# Altium schematic sheet 3) LPC1850_ PB-PF.SchDoc
size 420 x 297 mm
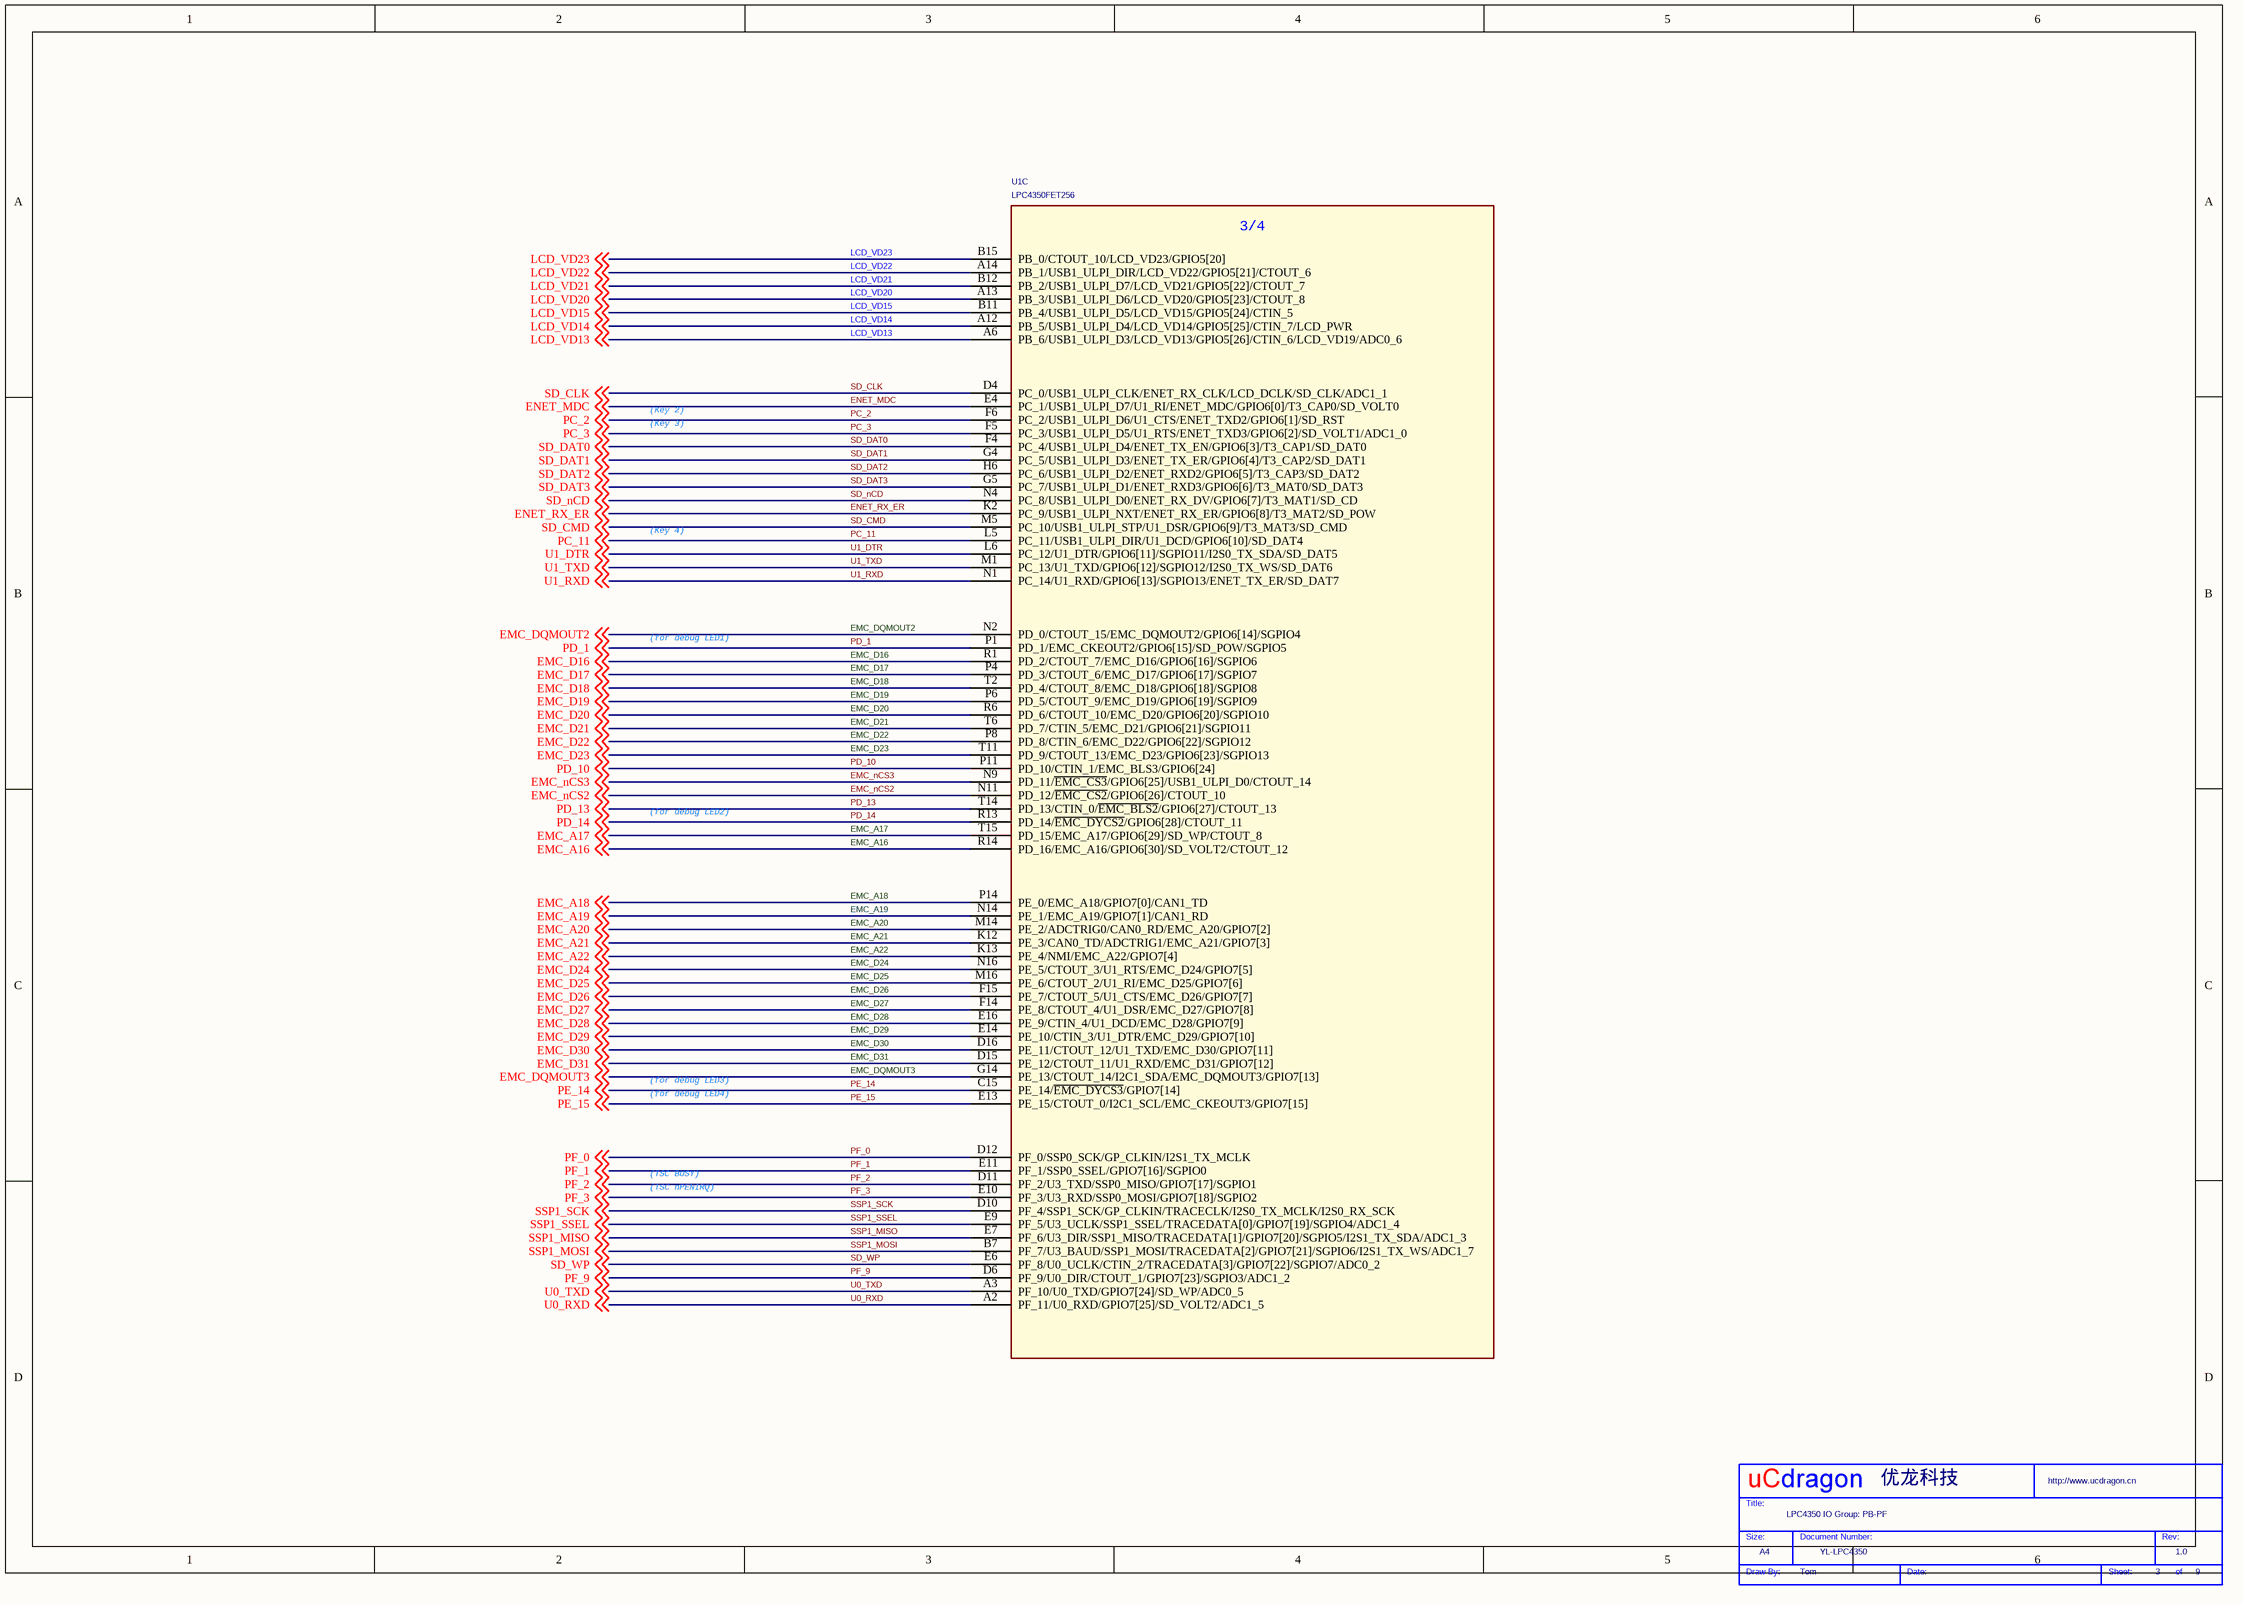
[diagram p0: 3) LPC1850_ PB-PF.SchDoc]

## Parts
*  Company: 优龙科技  Drawing: Tom  Doc: YL-LPC4350  RevCode: 1.0  Title: LPC4350 IO Group: PB-PF  Page Size: A4  Page Number: 3  Page Count: 9  (hidden comment: My Title 0)  (graphical)
U1  LPC4350FET256  [LBGA256]  (part C of 4)

## Nets
EMC_A16: U1.R14(PD_16/EMC_A16/GPIO6[30]/SD_VOLT2/CTOUT_12) ; off-sheet EMC_A16
EMC_A17: U1.T15(PD_15/EMC_A17/GPIO6[29]/SD_WP/CTOUT_8) ; off-sheet EMC_A17
EMC_A18: U1.P14(PE_0/EMC_A18/GPIO7[0]/CAN1_TD) ; off-sheet EMC_A18
EMC_A19: U1.N14(PE_1/EMC_A19/GPIO7[1]/CAN1_RD) ; off-sheet EMC_A19
EMC_A20: U1.M14(PE_2/ADCTRIG0/CAN0_RD/EMC_A20/GPIO7[2]) ; off-sheet EMC_A20
EMC_A21: U1.K12(PE_3/CAN0_TD/ADCTRIG1/EMC_A21/GPIO7[3]) ; off-sheet EMC_A21
EMC_A22: U1.K13(PE_4/NMI/EMC_A22/GPIO7[4]) ; off-sheet EMC_A22
EMC_D16: U1.R1(PD_2/CTOUT_7/EMC_D16/GPIO6[16]/SGPIO6) ; off-sheet EMC_D16
EMC_D17: U1.P4(PD_3/CTOUT_6/EMC_D17/GPIO6[17]/SGPIO7) ; off-sheet EMC_D17
EMC_D18: U1.T2(PD_4/CTOUT_8/EMC_D18/GPIO6[18]/SGPIO8) ; off-sheet EMC_D18
EMC_D19: U1.P6(PD_5/CTOUT_9/EMC_D19/GPIO6[19]/SGPIO9) ; off-sheet EMC_D19
EMC_D20: U1.R6(PD_6/CTOUT_10/EMC_D20/GPIO6[20]/SGPIO10) ; off-sheet EMC_D20
EMC_D21: U1.T6(PD_7/CTIN_5/EMC_D21/GPIO6[21]/SGPIO11) ; off-sheet EMC_D21
EMC_D22: U1.P8(PD_8/CTIN_6/EMC_D22/GPIO6[22]/SGPIO12) ; off-sheet EMC_D22
EMC_D23: U1.T11(PD_9/CTOUT_13/EMC_D23/GPIO6[23]/SGPIO13) ; off-sheet EMC_D23
EMC_D24: U1.N16(PE_5/CTOUT_3/U1_RTS/EMC_D24/GPIO7[5]) ; off-sheet EMC_D24
EMC_D25: U1.M16(PE_6/CTOUT_2/U1_RI/EMC_D25/GPIO7[6]) ; off-sheet EMC_D25
EMC_D26: U1.F15(PE_7/CTOUT_5/U1_CTS/EMC_D26/GPIO7[7]) ; off-sheet EMC_D26
EMC_D27: U1.F14(PE_8/CTOUT_4/U1_DSR/EMC_D27/GPIO7[8]) ; off-sheet EMC_D27
EMC_D28: U1.E16(PE_9/CTIN_4/U1_DCD/EMC_D28/GPIO7[9]) ; off-sheet EMC_D28
EMC_D29: U1.E14(PE_10/CTIN_3/U1_DTR/EMC_D29/GPIO7[10]) ; off-sheet EMC_D29
EMC_D30: U1.D16(PE_11/CTOUT_12/U1_TXD/EMC_D30/GPIO7[11]) ; off-sheet EMC_D30
EMC_D31: U1.D15(PE_12/CTOUT_11/U1_RXD/EMC_D31/GPIO7[12]) ; off-sheet EMC_D31
EMC_DQMOUT2: U1.N2(PD_0/CTOUT_15/EMC_DQMOUT2/GPIO6[14]/SGPIO4) ; off-sheet EMC_DQMOUT2
EMC_DQMOUT3: U1.G14(PE_13/CTOUT_14/I2C1_SDA/EMC_DQMOUT3/GPIO7[13]) ; off-sheet EMC_DQMOUT3
EMC_nCS2: U1.N11(PD_12/~{EMC_CS2}/GPIO6[26]/CTOUT_10) ; off-sheet EMC_nCS2
EMC_nCS3: U1.N9(PD_11/~{EMC_CS3}/GPIO6[25]/USB1_ULPI_D0/CTOUT_14) ; off-sheet EMC_nCS3
ENET_MDC: U1.E4(PC_1/USB1_ULPI_D7/U1_RI/ENET_MDC/GPIO6[0]/T3_CAP0/SD_VOLT0) ; off-sheet ENET_MDC
ENET_RX_ER: U1.K2(PC_9/USB1_ULPI_NXT/ENET_RX_ER/GPIO6[8]/T3_MAT2/SD_POW) ; off-sheet ENET_RX_ER
LCD_VD13: U1.A6(PB_6/USB1_ULPI_D3/LCD_VD13/GPIO5[26]/CTIN_6/LCD_VD19/ADC0_6) ; off-sheet LCD_VD13
LCD_VD14: U1.A12(PB_5/USB1_ULPI_D4/LCD_VD14/GPIO5[25]/CTIN_7/LCD_PWR) ; off-sheet LCD_VD14
LCD_VD15: U1.B11(PB_4/USB1_ULPI_D5/LCD_VD15/GPIO5[24]/CTIN_5) ; off-sheet LCD_VD15
LCD_VD20: U1.A13(PB_3/USB1_ULPI_D6/LCD_VD20/GPIO5[23]/CTOUT_8) ; off-sheet LCD_VD20
LCD_VD21: U1.B12(PB_2/USB1_ULPI_D7/LCD_VD21/GPIO5[22]/CTOUT_7) ; off-sheet LCD_VD21
LCD_VD22: U1.A14(PB_1/USB1_ULPI_DIR/LCD_VD22/GPIO5[21]/CTOUT_6) ; off-sheet LCD_VD22
LCD_VD23: U1.B15(PB_0/CTOUT_10/LCD_VD23/GPIO5[20]) ; off-sheet LCD_VD23
PC_2: U1.F6(PC_2/USB1_ULPI_D6/U1_CTS/ENET_TXD2/GPIO6[1]/SD_RST) ; off-sheet PC_2
PC_3: U1.F5(PC_3/USB1_ULPI_D5/U1_RTS/ENET_TXD3/GPIO6[2]/SD_VOLT1/ADC1_0) ; off-sheet PC_3
PC_11: U1.L5(PC_11/USB1_ULPI_DIR/U1_DCD/GPIO6[10]/SD_DAT4) ; off-sheet PC_11
PD_1: U1.P1(PD_1/EMC_CKEOUT2/GPIO6[15]/SD_POW/SGPIO5) ; off-sheet PD_1
PD_10: U1.P11(PD_10/CTIN_1/EMC_BLS3/GPIO6[24]) ; off-sheet PD_10
PD_13: U1.T14(PD_13/CTIN_0/~{EMC_BLS2}/GPIO6[27]/CTOUT_13) ; off-sheet PD_13
PD_14: U1.R13(PD_14/~{EMC_DYCS2}/GPIO6[28]/CTOUT_11) ; off-sheet PD_14
PE_14: U1.C15(PE_14/~{EMC_DYCS3}/GPIO7[14]) ; off-sheet PE_14
PE_15: U1.E13(PE_15/CTOUT_0/I2C1_SCL/EMC_CKEOUT3/GPIO7[15]) ; off-sheet PE_15
PF_0: U1.D12(PF_0/SSP0_SCK/GP_CLKIN/I2S1_TX_MCLK) ; off-sheet PF_0
PF_1: U1.E11(PF_1/SSP0_SSEL/GPIO7[16]/SGPIO0) ; off-sheet PF_1
PF_2: U1.D11(PF_2/U3_TXD/SSP0_MISO/GPIO7[17]/SGPIO1) ; off-sheet PF_2
PF_3: U1.E10(PF_3/U3_RXD/SSP0_MOSI/GPIO7[18]/SGPIO2) ; off-sheet PF_3
PF_9: U1.D6(PF_9/U0_DIR/CTOUT_1/GPIO7[23]/SGPIO3/ADC1_2) ; off-sheet PF_9
SD_CLK: U1.D4(PC_0/USB1_ULPI_CLK/ENET_RX_CLK/LCD_DCLK/SD_CLK/ADC1_1) ; off-sheet SD_CLK
SD_CMD: U1.M5(PC_10/USB1_ULPI_STP/U1_DSR/GPIO6[9]/T3_MAT3/SD_CMD) ; off-sheet SD_CMD
SD_DAT0: U1.F4(PC_4/USB1_ULPI_D4/ENET_TX_EN/GPIO6[3]/T3_CAP1/SD_DAT0) ; off-sheet SD_DAT0
SD_DAT1: U1.G4(PC_5/USB1_ULPI_D3/ENET_TX_ER/GPIO6[4]/T3_CAP2/SD_DAT1) ; off-sheet SD_DAT1
SD_DAT2: U1.H6(PC_6/USB1_ULPI_D2/ENET_RXD2/GPIO6[5]/T3_CAP3/SD_DAT2) ; off-sheet SD_DAT2
SD_DAT3: U1.G5(PC_7/USB1_ULPI_D1/ENET_RXD3/GPIO6[6]/T3_MAT0/SD_DAT3) ; off-sheet SD_DAT3
SD_nCD: U1.N4(PC_8/USB1_ULPI_D0/ENET_RX_DV/GPIO6[7]/T3_MAT1/SD_CD) ; off-sheet SD_nCD
SD_WP: U1.E6(PF_8/U0_UCLK/CTIN_2/TRACEDATA[3]/GPIO7[22]/SGPIO7/ADC0_2) ; off-sheet SD_WP
SSP1_MISO: U1.E7(PF_6/U3_DIR/SSP1_MISO/TRACEDATA[1]/GPIO7[20]/SGPIO5/I2S1_TX_SDA/ADC1_3) ; off-sheet SSP1_MISO
SSP1_MOSI: U1.B7(PF_7/U3_BAUD/SSP1_MOSI/TRACEDATA[2]/GPIO7[21]/SGPIO6/I2S1_TX_WS/ADC1_7) ; off-sheet SSP1_MOSI
SSP1_SCK: U1.D10(PF_4/SSP1_SCK/GP_CLKIN/TRACECLK/I2S0_TX_MCLK/I2S0_RX_SCK) ; off-sheet SSP1_SCK
SSP1_SSEL: U1.E9(PF_5/U3_UCLK/SSP1_SSEL/TRACEDATA[0]/GPIO7[19]/SGPIO4/ADC1_4) ; off-sheet SSP1_SSEL
U0_RXD: U1.A2(PF_11/U0_RXD/GPIO7[25]/SD_VOLT2/ADC1_5) ; off-sheet U0_RXD
U0_TXD: U1.A3(PF_10/U0_TXD/GPIO7[24]/SD_WP/ADC0_5) ; off-sheet U0_TXD
U1_DTR: U1.L6(PC_12/U1_DTR/GPIO6[11]/SGPIO11/I2S0_TX_SDA/SD_DAT5) ; off-sheet U1_DTR
U1_RXD: U1.N1(PC_14/U1_RXD/GPIO6[13]/SGPIO13/ENET_TX_ER/SD_DAT7) ; off-sheet U1_RXD
U1_TXD: U1.M1(PC_13/U1_TXD/GPIO6[12]/SGPIO12/I2S0_TX_WS/SD_DAT6) ; off-sheet U1_TXD

## Notes on the sheet
- (Key 2)
- (Key 3)
- (Key 4)
- (for debug LED1)
- (for debug LED2)
- (for debug LED3)
- (for debug LED4)
- (TSC nPENIRQ)
- (TSC BUSY)
- (in symbol LPC4350FET256, part C) 3/4
- (in symbol My Title 0) Title:; Size:; Document Number:; Rev:; Draw By:; Date:; Sheet:; of

## Library data of the parts
* = My Title 0: WebSite: http://www.ucdragon.cn; Page Create Date: May 29, 2006